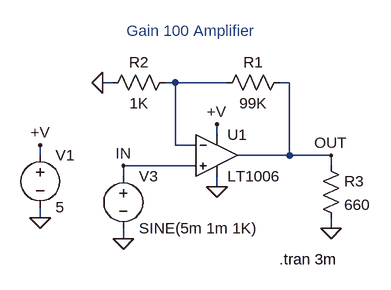
[diagram p0: schematic 1006.asc]
1006.asc, the LTspice schematic file:
Version 4
SHEET 1 896 680
WIRE 32 128 16 128
WIRE 128 128 112 128
WIRE 208 128 128 128
WIRE 304 128 288 128
WIRE 192 208 192 192
WIRE 128 224 128 128
WIRE 160 224 128 224
WIRE -80 240 -80 224
WIRE 304 240 304 128
WIRE 304 240 224 240
WIRE 368 240 304 240
WIRE 160 256 48 256
WIRE 368 256 368 240
WIRE 48 272 48 256
WIRE 192 288 192 272
WIRE -80 336 -80 320
WIRE 368 352 368 336
WIRE 48 368 48 352
FLAG -80 336 0
FLAG 192 192 +V
FLAG -80 224 +V
FLAG 16 128 0
FLAG 48 368 0
FLAG 192 288 0
FLAG 368 352 0
FLAG 48 256 IN
FLAG 368 240 OUT
SYMBOL voltage -80 224 R0
SYMATTR InstName V1
SYMATTR Value 5
SYMBOL res 304 112 R90
WINDOW 0 0 56 VBottom 0
WINDOW 3 32 56 VTop 0
SYMATTR InstName R1
SYMATTR Value 99K
SYMBOL res 128 112 R90
WINDOW 0 0 56 VBottom 0
WINDOW 3 32 56 VTop 0
SYMATTR InstName R2
SYMATTR Value 1K
SYMBOL voltage 48 256 R0
SYMATTR InstName V3
SYMATTR Value SINE(5m 1m 1K)
SYMBOL opamps\\LT1006 192 176 R0
SYMATTR InstName U1
SYMBOL res 352 240 R0
SYMATTR InstName R3
SYMATTR Value 660
TEXT 288 400 Left 0 !.tran 3m
TEXT 152 64 Bottom 0 ;Gain 100 Amplifier

The netlist it stands for:
* 1006.asc
V1 +V 0 5
R1 OUT N001 99K
R2 N001 0 1K
V3 IN 0 SINE(5m 1m 1K)
XU1 IN N001 +V 0 OUT LT1006  ; pins In+ In- V+ V- OUT
R3 OUT 0 660
.tran 3m
* Gain 100 Amplifier
.lib LTC.lib
.backanno
.end